# EAGLE schematic untitled (EAGLE 6.5.0)
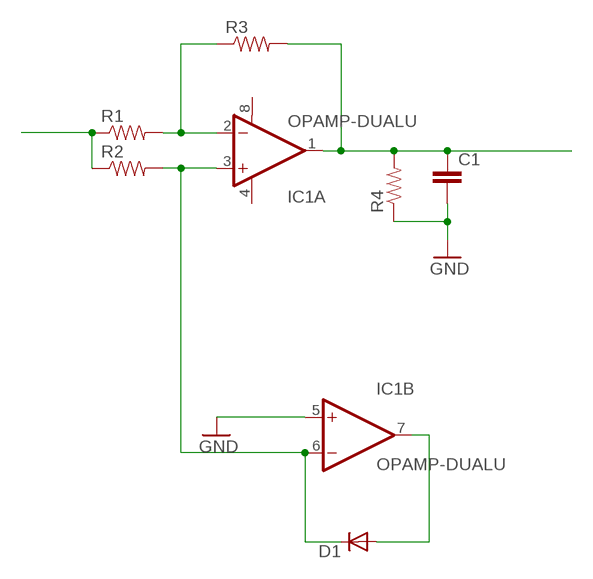
[diagram p0: schematic, sheet 1]

## Parts
C1  CAP_  [AXIAL-5MM]
D1  DIODEPTH  [DIODE-1N4001]
IC1  OPAMP-DUALU  [SO08]
R1  RESISTORPTH-1/6W  [1/6W-RES]
R2  RESISTORPTH-1/6W  [1/6W-RES]
R3  RESISTORPTH-1/6W  [1/6W-RES]
R4  RESISTORPTH-1/6W  [1/6W-RES]

## Nets
GND: C1.P$2 IC1.5(B:+IN) R4.1
N$1: C1.P$1 IC1.1(A:OUT) R3.2 R4.2
N$2: IC1.2(A:-IN) R1.2 R3.1
N$4: D1.C IC1.3(A:+IN) IC1.6(B:-IN) R2.2
N$5: D1.A IC1.7(B:OUT)
N$6: R1.1 R2.1

## Power pins joined to a net without a drawn wire
V+: IC1.8(A:V+)
V-: IC1.4(A:V-)

## Library data of the parts
C1 = SparkFun-Capacitors:CAP: Capacitor Standard 0603 ceramic capacitor, and 0.1" leaded capacitor.
D1 = SparkFun-DiscreteSemi:DIODE: Diode These are standard reverse protection diodes and small signal diodes. SMA package can handle up to about 1A. SOD-323 can handle about 200mA. What the SOD-323 package when ordering, there are some mfgs out there that are 5-pin packages.
IC1 = SparkFun-AnalogIC:OPAMP-DUAL: Generic op-amp footprint
R1-R4 = SparkFun-Passives:RESISTOR: Resistor Basic schematic elements and footprints for 0603, 1206, and PTH resistors.